# Altium project helix_4_single_shield_host.PrjPcb
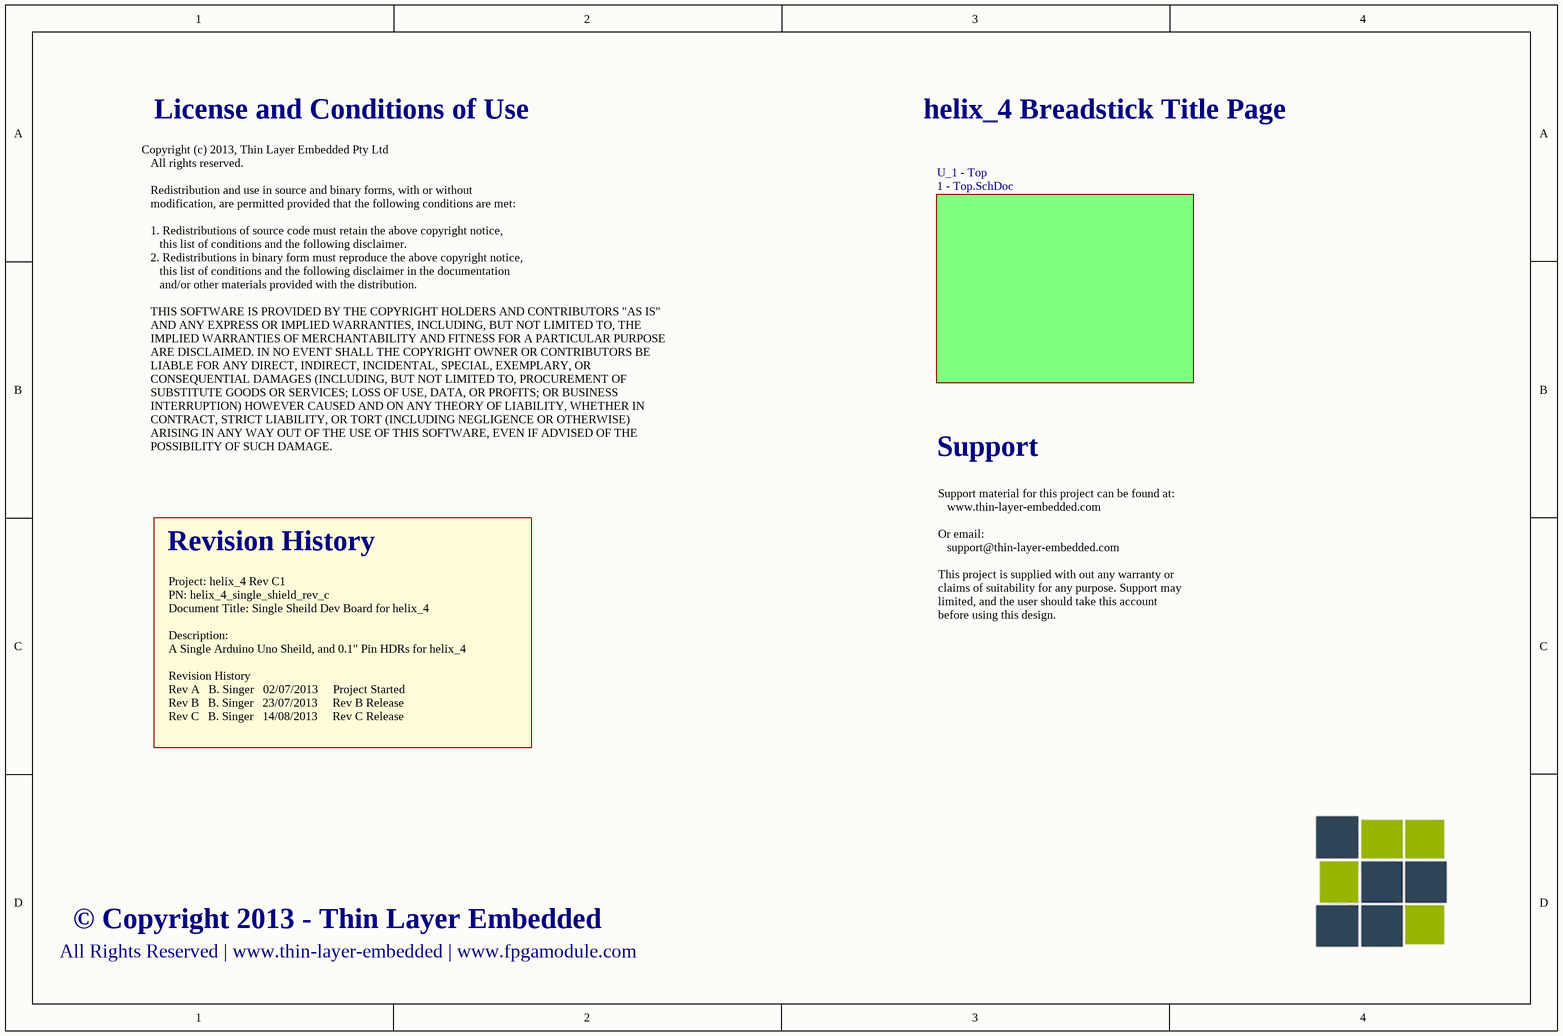
[diagram p0: 0 - Title.SchDoc]
4 sheets, 77 parts. Net scope: flat (ports and power ports of the same name join across sheets).
Board file: helix_4_single_shield_host.PcbDoc
Sheets:
  0 - Title.SchDoc
    U_1 - Top = 1 - Top.SchDoc
      U_3 - PSOC Blaster.ADC = 3 - PSOC & Power.SchDoc
      U_2 - IO Socket 0 = 2 - IO Socket 0.SchDoc

## Sheet 0 - Title.SchDoc
size A4

### Sub-sheets
U_1 - Top = 1 - Top.SchDoc: no entries

### Notes on the sheet
- License and Conditions of Use
- helix_4 Breadstick Title Page
- Copyright (c) 2013, Thin Layer Embedded Pty Ltd
  All rights reserved.
  Redistribution and use in source and binary forms, with or without
  modification, are permitted provided that the following conditions are met:
  1. Redistributions of source code must retain the above copyright notice,
  this list of conditions and the following disclaimer.
  2. Redistributions in binary form must reproduce the above copyright notice,
  this list of conditions and the following disclaimer in the documentation
  and/or other materials provided with the distribution.
  THIS SOFTWARE IS PROVIDED BY THE COPYRIGHT HOLDERS AND CONTRIBUTORS "AS IS"
  AND ANY EXPRESS OR IMPLIED WARRANTIES, INCLUDING, BUT NOT LIMITED TO, THE
  IMPLIED WARRANTIES OF MERCHANTABILITY AND FITNESS FOR A PARTICULAR PURPOSE
  ARE DISCLAIMED. IN NO EVENT SHALL THE COPYRIGHT OWNER OR CONTRIBUTORS BE
  LIABLE FOR ANY DIRECT, INDIRECT, INCIDENTAL, SPECIAL, EXEMPLARY, OR
  CONSEQUENTIAL DAMAGES (INCLUDING, BUT NOT LIMITED TO, PROCUREMENT OF
  SUBSTITUTE GOODS OR SERVICES; LOSS OF USE, DATA, OR PROFITS; OR BUSINESS
  INTERRUPTION) HOWEVER CAUSED AND ON ANY THEORY OF LIABILITY, WHETHER IN
  CONTRACT, STRICT LIABILITY, OR TORT (INCLUDING NEGLIGENCE OR OTHERWISE)
  ARISING IN ANY WAY OUT OF THE USE OF THIS SOFTWARE, EVEN IF ADVISED OF THE
  POSSIBILITY OF SUCH DAMAGE.
- Support
- Revision History
- Support material for this project can be found at:
  www.thin-layer-embedded.com
  Or email:
  support@thin-layer-embedded.com
  This project is supplied with out any warranty or
  claims of suitability for any purpose. Support may
  limited, and the user should take this account
  before using this design.
- Project: helix_4 Rev C1
  PN: helix_4_single_shield_rev_c
  Document Title: Single Sheild Dev Board for helix_4
  Description:
  A Single Arduino Uno Sheild, and 0.1" Pin HDRs for helix_4
  Revision History
  Rev A   B. Singer   02/07/2013     Project Started
  Rev B   B. Singer   23/07/2013     Rev B Release
  Rev C   B. Singer   14/08/2013     Rev C Release
- All Rights Reserved | www.thin-layer-embedded | www.fpgamodule.com
- © Copyright 2013 - Thin Layer Embedded

## Sheet 1 - Top.SchDoc
size A3; PageSetup: Record=PageOptions|CenterHorizontal=True|CenterVertical=True|PrintScale=0.71|XCorrection=1.00|YCorrection=1.00|PrintKind=0|BorderSize=5000000|LeftOffset=0|BottomOffset=0|Orientation=2|PaperLength=2970|PaperWidth=2100|Scale=100|PaperSource=7|PrintQuality=-4|MediaType=1|DitherType=10|PaperKind=A4 (210 x 297 mm)|PrintScaleMode=1
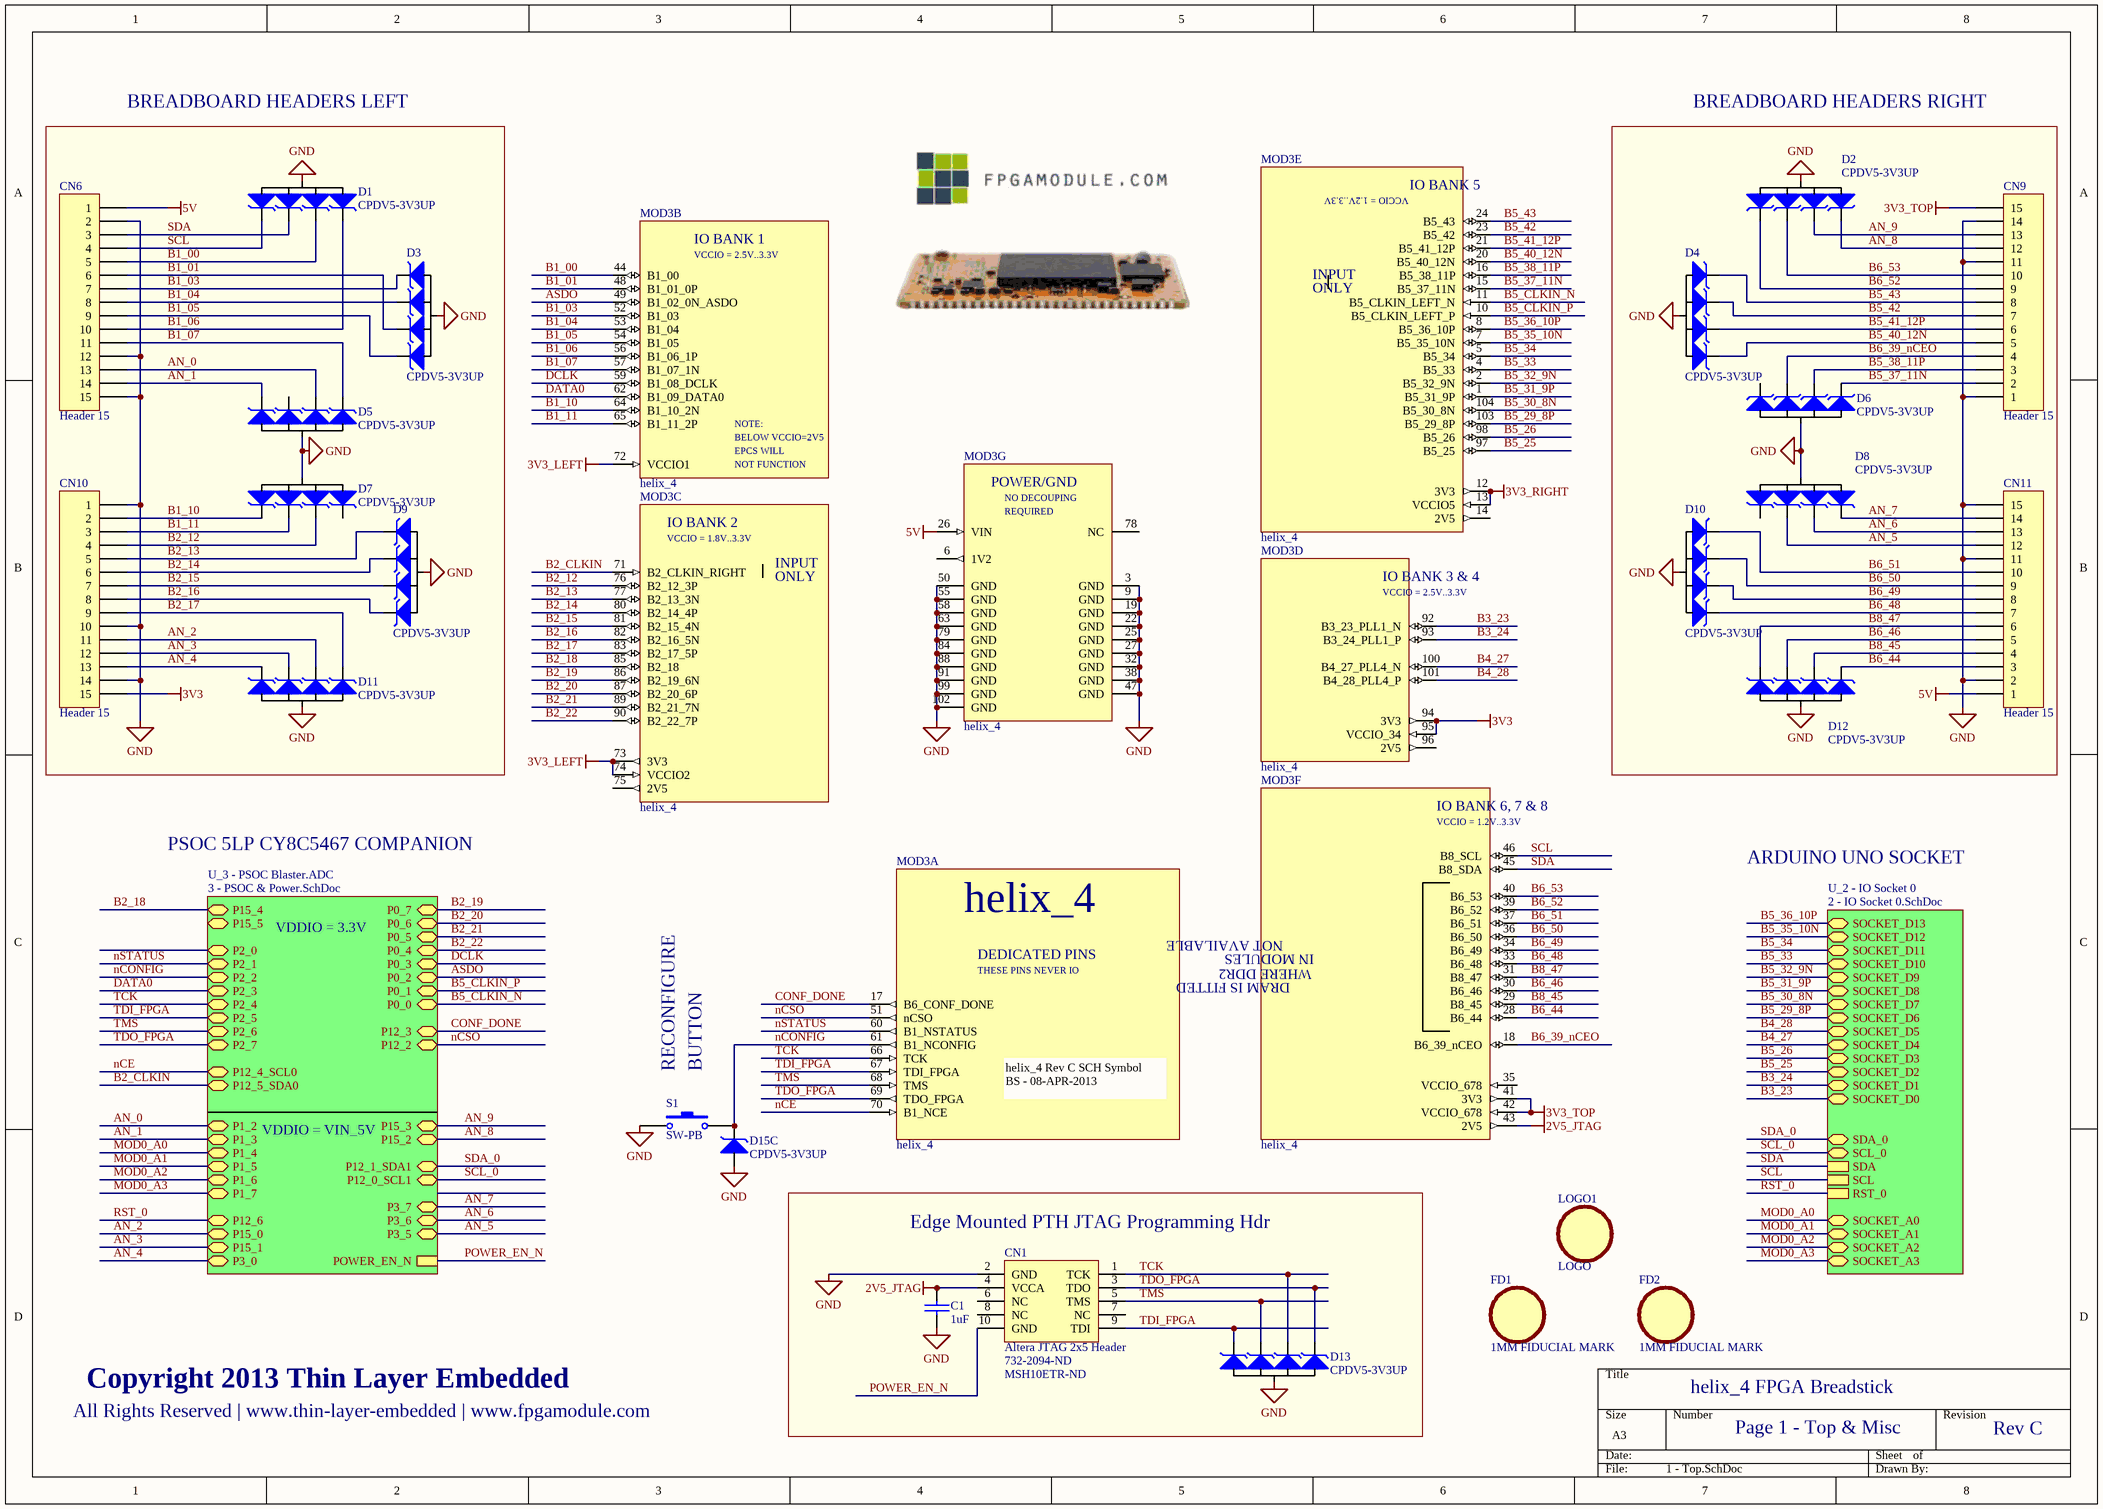
[diagram p1: 1 - Top.SchDoc]

### Parts
C1  1uF  [0805]
CN1  Altera JTAG 2x5 Header  Supplier Part Number 1: 732-2094-ND  Supplier Part Number 2: MSH10ETR-ND  [BOXHDR2X5_EDGE]
CN6  Header 15  [HDR1X15]
CN9  Header 15  [HDR1X15]
CN10  Header 15  [HDR1X15]
CN11  Header 15  [HDR1X15]
D1  CPDV5-3V3UP  [SOT-353]
D2  CPDV5-3V3UP  [SOT-353]
D3  CPDV5-3V3UP  [SOT-353]
D4  CPDV5-3V3UP  [SOT-353]
D5  CPDV5-3V3UP  [SOT-353]
D6  CPDV5-3V3UP  [SOT-353]
D7  CPDV5-3V3UP  [SOT-353]
D8  CPDV5-3V3UP  [SOT-353]
D9  CPDV5-3V3UP  [SOT-353]
D10  CPDV5-3V3UP  [SOT-353]
D11  CPDV5-3V3UP  [SOT-353]
D12  CPDV5-3V3UP  [SOT-353]
D13  CPDV5-3V3UP  [SOT-353]
D15  CPDV5-3V3UP  [sot-353]  (part C of 4)
FD1  1MM FIDUCIAL MARK  [FID_1MM]
FD2  1MM FIDUCIAL MARK  [FID_1MM]
LOGO1  LOGO  [LOGO_SMALL - SILK]
MOD3  helix_4  [HELIX_4_LCC104_HOST]  (parts A,B,C,D,E,F,G of 7)
S1  SW-PB  [FSM4JSMA]

### Blocks framed on the sheet
BREADBOARD HEADERS LEFT: CN6 CN10 D1 D3 D5 D7 D9 D11
BREADBOARD HEADERS RIGHT: CN9 CN11 D2 D4 D6 D8 D10 D12
Edge Mounted PTH JTAG Programming Hdr: C1 CN1 D13

### Sub-sheets
U_2 - IO Socket 0 = 2 - IO Socket 0.SchDoc: SCL, SDA, SDA_0, SCL_0, SOCKET_A0, SOCKET_A1, SOCKET_A2, SOCKET_A3, SOCKET_D0, SOCKET_D1, SOCKET_D2, SOCKET_D3, SOCKET_D4, SOCKET_D5, SOCKET_D6, SOCKET_D7, SOCKET_D8, SOCKET_D9, SOCKET_D10, SOCKET_D11, SOCKET_D12, SOCKET_D13, RST_0
U_3 - PSOC Blaster.ADC = 3 - PSOC & Power.SchDoc: P15_4, P15_5, P12_6, P2_0, P1_5, P1_6, P1_7, P2_1, P2_2, P2_3, P2_4, P2_5, P2_6, P2_7, P12_3, P12_2, POWER_EN_N, P0_0, P1_4, P1_3, P12_4_SCL0, P12_5_SDA0, P12_1_SDA1, P12_0_SCL1, P1_2, P0_1, P0_2, P0_3, P0_4, P0_5, P0_6, P0_7, P3_5, P3_6, P3_7, P15_0, P15_2, P15_3, P15_1, P3_0

### Nets
2V5_JTAG: C1.2 CN1.4(VCCA) MOD3.43(2V5)
3V3: CN10.15 MOD3.94(3V3) MOD3.95(VCCIO_34)
3V3_LEFT: MOD3.72(VCCIO1) MOD3.73(3V3) MOD3.74(VCCIO2)
3V3_RIGHT: MOD3.12(3V3) MOD3.13(VCCIO5)
3V3_TOP: CN9.15 MOD3.41(3V3) MOD3.42(VCCIO_678)
5V: CN6.1 CN11.1 MOD3.26(VIN)
GND: C1.1 CN1.2(GND) CN6.2 CN6.12 CN6.15 CN9.1 CN9.11 CN9.14 CN10.1 CN10.10 CN10.14 CN11.2 CN11.11 CN11.15 D1.2(A) D2.2(A) D3.2(A) D4.2(A) D5.2(A) D6.2(A) D7.2(A) D8.2(A) D9.2(A) D10.2(A) D11.2(A) D12.2(A) D13.2(A) D15.2(A) MOD3.3(GND) MOD3.9(GND) MOD3.19(GND) MOD3.22(GND) MOD3.25(GND) MOD3.27(GND) MOD3.32(GND) MOD3.38(GND) MOD3.47(GND) MOD3.50(GND) MOD3.55(GND) MOD3.58(GND) MOD3.63(GND) MOD3.79(GND) MOD3.84(GND) MOD3.88(GND) MOD3.91(GND) MOD3.99(GND) MOD3.102(GND) S1.1
AN_0: CN6.13 D5.5(K1) ; sheet U_3 - PSOC Blaster.ADC/P1_2
AN_1: CN6.14 D5.3(K1) ; sheet U_3 - PSOC Blaster.ADC/P1_3
AN_2: CN10.11 D11.5(K1) ; sheet U_3 - PSOC Blaster.ADC/P15_0
AN_3: CN10.12 D11.1(K2) ; sheet U_3 - PSOC Blaster.ADC/P15_1
AN_4: CN10.13 D11.3(K1) ; sheet U_3 - PSOC Blaster.ADC/P3_0
AN_5: CN11.12 D8.5(K1) ; sheet U_3 - PSOC Blaster.ADC/P3_5
AN_6: CN11.13 D8.1(K2) ; sheet U_3 - PSOC Blaster.ADC/P3_6
AN_7: CN11.14 D8.3(K1) ; sheet U_3 - PSOC Blaster.ADC/P3_7
AN_8: CN9.12 D2.4(K2) ; sheet U_3 - PSOC Blaster.ADC/P15_2
AN_9: CN9.13 D2.5(K1) ; sheet U_3 - PSOC Blaster.ADC/P15_3
ASDO: MOD3.49(B1_02_0N_ASDO) ; sheet U_3 - PSOC Blaster.ADC/P0_2
B1_00: CN6.5 D1.1(K2) MOD3.44(B1_00)
B1_01: CN6.6 D3.5(K1) MOD3.48(B1_01_0P)
B1_03: CN6.7 D3.3(K1) MOD3.52(B1_03)
B1_04: CN6.8 D3.1(K2) MOD3.53(B1_04)
B1_05: CN6.9 D3.4(K2) MOD3.54(B1_05)
B1_06: CN6.10 D1.3(K1) MOD3.56(B1_06_1P)
B1_07: CN6.11 D5.4(K2) MOD3.57(B1_07_1N)
B1_10: CN10.2 D7.4(K2) MOD3.64(B1_10_2N)
B1_11: CN10.3 D7.5(K1) MOD3.65(B1_11_2P)
B2_12: CN10.4 D7.1(K2) MOD3.76(B2_12_3P)
B2_13: CN10.5 D9.4(K2) MOD3.77(B2_13_3N)
B2_14: CN10.6 D9.5(K1) MOD3.80(B2_14_4P)
B2_15: CN10.7 D9.1(K2) MOD3.81(B2_15_4N)
B2_16: CN10.8 D9.3(K1) MOD3.82(B2_16_5N)
B2_17: CN10.9 D11.4(K2) MOD3.83(B2_17_5P)
B2_18: MOD3.85(B2_18) ; sheet U_3 - PSOC Blaster.ADC/P15_4
B2_19: MOD3.86(B2_19_6N) ; sheet U_3 - PSOC Blaster.ADC/P0_7
B2_20: MOD3.87(B2_20_6P) ; sheet U_3 - PSOC Blaster.ADC/P0_6
B2_21: MOD3.89(B2_21_7N) ; sheet U_3 - PSOC Blaster.ADC/P0_5
B2_22: MOD3.90(B2_22_7P) ; sheet U_3 - PSOC Blaster.ADC/P0_4
B2_CLKIN: MOD3.71(B2_CLKIN_RIGHT) ; sheet U_3 - PSOC Blaster.ADC/P12_5_SDA0
B3_23: MOD3.92(B3_23_PLL1_N) ; sheet U_2 - IO Socket 0/SOCKET_D0
B3_24: MOD3.93(B3_24_PLL1_P) ; sheet U_2 - IO Socket 0/SOCKET_D1
B4_27: MOD3.100(B4_27_PLL4_N) ; sheet U_2 - IO Socket 0/SOCKET_D4
B4_28: MOD3.101(B4_28_PLL4_P) ; sheet U_2 - IO Socket 0/SOCKET_D5
B5_25: MOD3.97(B5_25) ; sheet U_2 - IO Socket 0/SOCKET_D2
B5_26: MOD3.98(B5_26) ; sheet U_2 - IO Socket 0/SOCKET_D3
B5_29_8P: MOD3.103(B5_29_8P) ; sheet U_2 - IO Socket 0/SOCKET_D6
B5_30_8N: MOD3.104(B5_30_8N) ; sheet U_2 - IO Socket 0/SOCKET_D7
B5_31_9P: MOD3.1(B5_31_9P) ; sheet U_2 - IO Socket 0/SOCKET_D8
B5_32_9N: MOD3.2(B5_32_9N) ; sheet U_2 - IO Socket 0/SOCKET_D9
B5_33: MOD3.4(B5_33) ; sheet U_2 - IO Socket 0/SOCKET_D10
B5_34: MOD3.5(B5_34) ; sheet U_2 - IO Socket 0/SOCKET_D11
B5_35_10N: MOD3.7(B5_35_10N) ; sheet U_2 - IO Socket 0/SOCKET_D12
B5_36_10P: MOD3.8(B5_36_10P) ; sheet U_2 - IO Socket 0/SOCKET_D13
B5_37_11N: CN9.2 D6.3(K1) MOD3.15(B5_37_11N)
B5_38_11P: CN9.3 D6.1(K2) MOD3.16(B5_38_11P)
B5_40_12N: CN9.5 D4.3(K1) MOD3.20(B5_40_12N)
B5_41_12P: CN9.6 D4.1(K2) MOD3.21(B5_41_12P)
B5_42: CN9.7 D4.5(K1) MOD3.23(B5_42)
B5_43: CN9.8 D4.4(K2) MOD3.24(B5_43)
B5_CLKIN_N: MOD3.11(B5_CLKIN_LEFT_N) ; sheet U_3 - PSOC Blaster.ADC/P0_0
B5_CLKIN_P: MOD3.10(B5_CLKIN_LEFT_P) ; sheet U_3 - PSOC Blaster.ADC/P0_1
B6_39_nCEO: CN9.4 D6.5(K1) MOD3.18(B6_39_nCEO)
B6_44: CN11.3 D12.4(K2) MOD3.28(B6_44)
B6_46: CN11.5 D12.1(K2) MOD3.30(B6_46)
B6_48: CN11.7 D10.4(K2) MOD3.33(B6_48)
B6_49: CN11.8 D10.5(K1) MOD3.34(B6_49)
B6_50: CN11.9 D10.1(K2) MOD3.36(B6_50)
B6_51: CN11.10 D10.3(K1) MOD3.37(B6_51)
B6_52: CN9.9 D2.3(K1) MOD3.39(B6_52)
B6_53: CN9.10 D2.1(K2) MOD3.40(B6_53)
B8_45: CN11.4 D12.5(K1) MOD3.29(B8_45)
B8_47: CN11.6 D12.3(K1) MOD3.31(B8_47)
CONF_DONE: MOD3.17(B6_CONF_DONE) ; sheet U_3 - PSOC Blaster.ADC/P12_3
DATA0: MOD3.62(B1_09_DATA0) ; sheet U_3 - PSOC Blaster.ADC/P2_3
DCLK: MOD3.59(B1_08_DCLK) ; sheet U_3 - PSOC Blaster.ADC/P0_3
MOD0_A0: sheet U_3 - PSOC Blaster.ADC/P1_4, sheet U_2 - IO Socket 0/SOCKET_A0
MOD0_A1: sheet U_3 - PSOC Blaster.ADC/P1_5, sheet U_2 - IO Socket 0/SOCKET_A1
MOD0_A2: sheet U_3 - PSOC Blaster.ADC/P1_6, sheet U_2 - IO Socket 0/SOCKET_A2
MOD0_A3: sheet U_3 - PSOC Blaster.ADC/P1_7, sheet U_2 - IO Socket 0/SOCKET_A3
nCE: MOD3.70(B1_NCE) ; sheet U_3 - PSOC Blaster.ADC/P12_4_SCL0
nCONFIG: D15.5(K3) MOD3.61(B1_NCONFIG) S1.2 ; sheet U_3 - PSOC Blaster.ADC/P2_2
nCSO: MOD3.51(nCSO) ; sheet U_3 - PSOC Blaster.ADC/P12_2
nSTATUS: MOD3.60(B1_NSTATUS) ; sheet U_3 - PSOC Blaster.ADC/P2_1
POWER_EN_N: CN1.10(GND) ; sheet U_3 - PSOC Blaster.ADC/POWER_EN_N
RST_0: sheet U_3 - PSOC Blaster.ADC/P12_6, sheet U_2 - IO Socket 0/RST_0
SCL: CN6.4 D1.4(K2) MOD3.46(B8_SCL) ; sheet U_2 - IO Socket 0/SCL
SCL_0: sheet U_3 - PSOC Blaster.ADC/P12_0_SCL1, sheet U_2 - IO Socket 0/SCL_0
SDA: CN6.3 D1.5(K1) MOD3.45(B8_SDA) ; sheet U_2 - IO Socket 0/SDA
SDA_0: sheet U_3 - PSOC Blaster.ADC/P12_1_SDA1, sheet U_2 - IO Socket 0/SDA_0
TCK: CN1.1(TCK) D13.5(K1) MOD3.66(TCK) ; sheet U_3 - PSOC Blaster.ADC/P2_4
TDI_FPGA: CN1.9(TDI) D13.3(K1) MOD3.67(TDI_FPGA) ; sheet U_3 - PSOC Blaster.ADC/P2_5
TDO_FPGA: CN1.3(TDO) D13.4(K2) MOD3.69(TDO_FPGA) ; sheet U_3 - PSOC Blaster.ADC/P2_7
TMS: CN1.5(TMS) D13.1(K2) MOD3.68(TMS) ; sheet U_3 - PSOC Blaster.ADC/P2_6

Not connected (* = marked no-connect by the designer): CN1 6(NC) 7(NC) 8(NC); D5 1(K2); D6 4(K2); D7 3(K1); D8 4(K2); FD1 1(FID); FD2 1(FID); LOGO1 1(FID); MOD3 6(1V2) 14(2V5) 35(VCCIO_678) 75(2V5) 78(NC) 96(2V5)

### Notes on the sheet
- PSOC 5LP CY8C5467 COMPANION
- ARDUINO UNO SOCKET
- VDDIO = 3.3V
- RECONFIGURE
- BUTTON
- VDDIO = VIN_5V
- Copyright 2013 Thin Layer Embedded
- helix_4 FPGA Breadstick
- All Rights Reserved | www.thin-layer-embedded | www.fpgamodule.com
- Page 1 - Top & Misc
- Rev C
- (in symbol helix_4 Rev C Module, part A) DEDICATED PINS; THESE PINS NEVER IO; helix_4 Rev C SCH Symbol / BS - 08-APR-2013 /
- (in symbol helix_4 Rev C Module, part B) IO BANK 1; VCCIO = 2.5V..3.3V; NOTE:; BELOW VCCIO=2V5; EPCS WILL; NOT FUNCTION
- (in symbol helix_4 Rev C Module, part C) IO BANK 2; VCCIO = 1.8V..3.3V; INPUT; ONLY
- (in symbol helix_4 Rev C Module, part D) IO BANK 3 & 4; VCCIO = 2.5V..3.3V
- (in symbol helix_4 Rev C Module, part E) IO BANK 5; VCCIO = 1.2V..3.3V; INPUT; ONLY
- (in symbol helix_4 Rev C Module, part F) IO BANK 6, 7 & 8; VCCIO = 1.2V..3.3V; NOT AVAILABLE; IN MODULES; WHERE DDR2; DRAM IS FITTED
- (in symbol helix_4 Rev C Module, part G) POWER/GND; NO DECOUPING; REQUIRED

### Library data of the parts
C1 = CAP: Capacitor
CN1 = Altera JTAG 2x5 Header: Header, 5-Pin, Dual row; Manufacturer: Wurth Electronics Inc; Manufacturer Part Number: 61201021621; Description: BOX HEADER 2.54MM MALE STR 10POS; Connector Type: Header, Shrouded; Number of Positions: 10; Number of Positions Loaded: All; Pitch: 0.100" (2.54mm); LatestRevisionDate: 17-Jul-2002; LatestRevisionNote: Re-released for DXP Platform.; Publisher: Altium Limited; Supplier 1: Digi-Key; RoHS: RoHS Compliant; Category: Connectors, Interconnects; Stock 1: 324; Pricing 1: 1=0.97, 25=0.8052, 100=0.713, 250=0.63252, 500=0.575, 1000=0.46, 2500=0.4025, 5000=0.3335, 10000=0.3059 (USD); Contact Type: Male Pin; Number of Rows: 2; Row Spacing: 0.100" (2.54mm); Contact Mating Length: -; Mounting Type: Through Hole; Termination: Solder; Fastening Type: -; Features: -; Contact Finish: Gold; Contact Finish Thickness: -; Color: Black; Packaging: Tray; ComponentLink1URL: http://www.we-online.de/eican/media/pdf/6120xx21621.pdf; ComponentLink1Description: http://www.we-online.de/eican/media/pdf/6120xx21621.pdf; Supplier 2: Digi-Key
CN6 CN9-CN11 = Header 15: Header, 15-Pin; LatestRevisionDate: 17-Jul-2002; LatestRevisionNote: Re-released for DXP Platform.; Publisher: Altium Limited
D1-D13 = 4CH ESD DIODE: 4CH ESD DIODE 3V3/3.5V
D15 = 4CH ESD DIODE (SPLIT): 4CH ESD DIODE 3V3/3.5V
FD1 FD2 LOGO1 = FID
MOD3 = helix_4 Rev C Module
S1 = SW-PB: Switch; Published: 24-Mar-1999; LatestRevisionDate: 17-Jul-2002; LatestRevisionNote: Re-released for DXP Platform.; PackageReference: SPST-2; Publisher: Altium Limited

## Sheet 3 - PSOC & Power.SchDoc
size A3; PageSetup: Record=PageOptions|CenterHorizontal=True|CenterVertical=True|PrintScale=1.00|XCorrection=1.00|YCorrection=1.00|PrintKind=1|BorderSize=5000000|LeftOffset=0|BottomOffset=0|Orientation=2|PaperLength=2970|PaperWidth=2100|Scale=100|PaperSource=7|PrintQuality=-4|MediaType=1|DitherType=10|PaperKind=A4 (210 x 297 mm)|PrintScaleMode=0
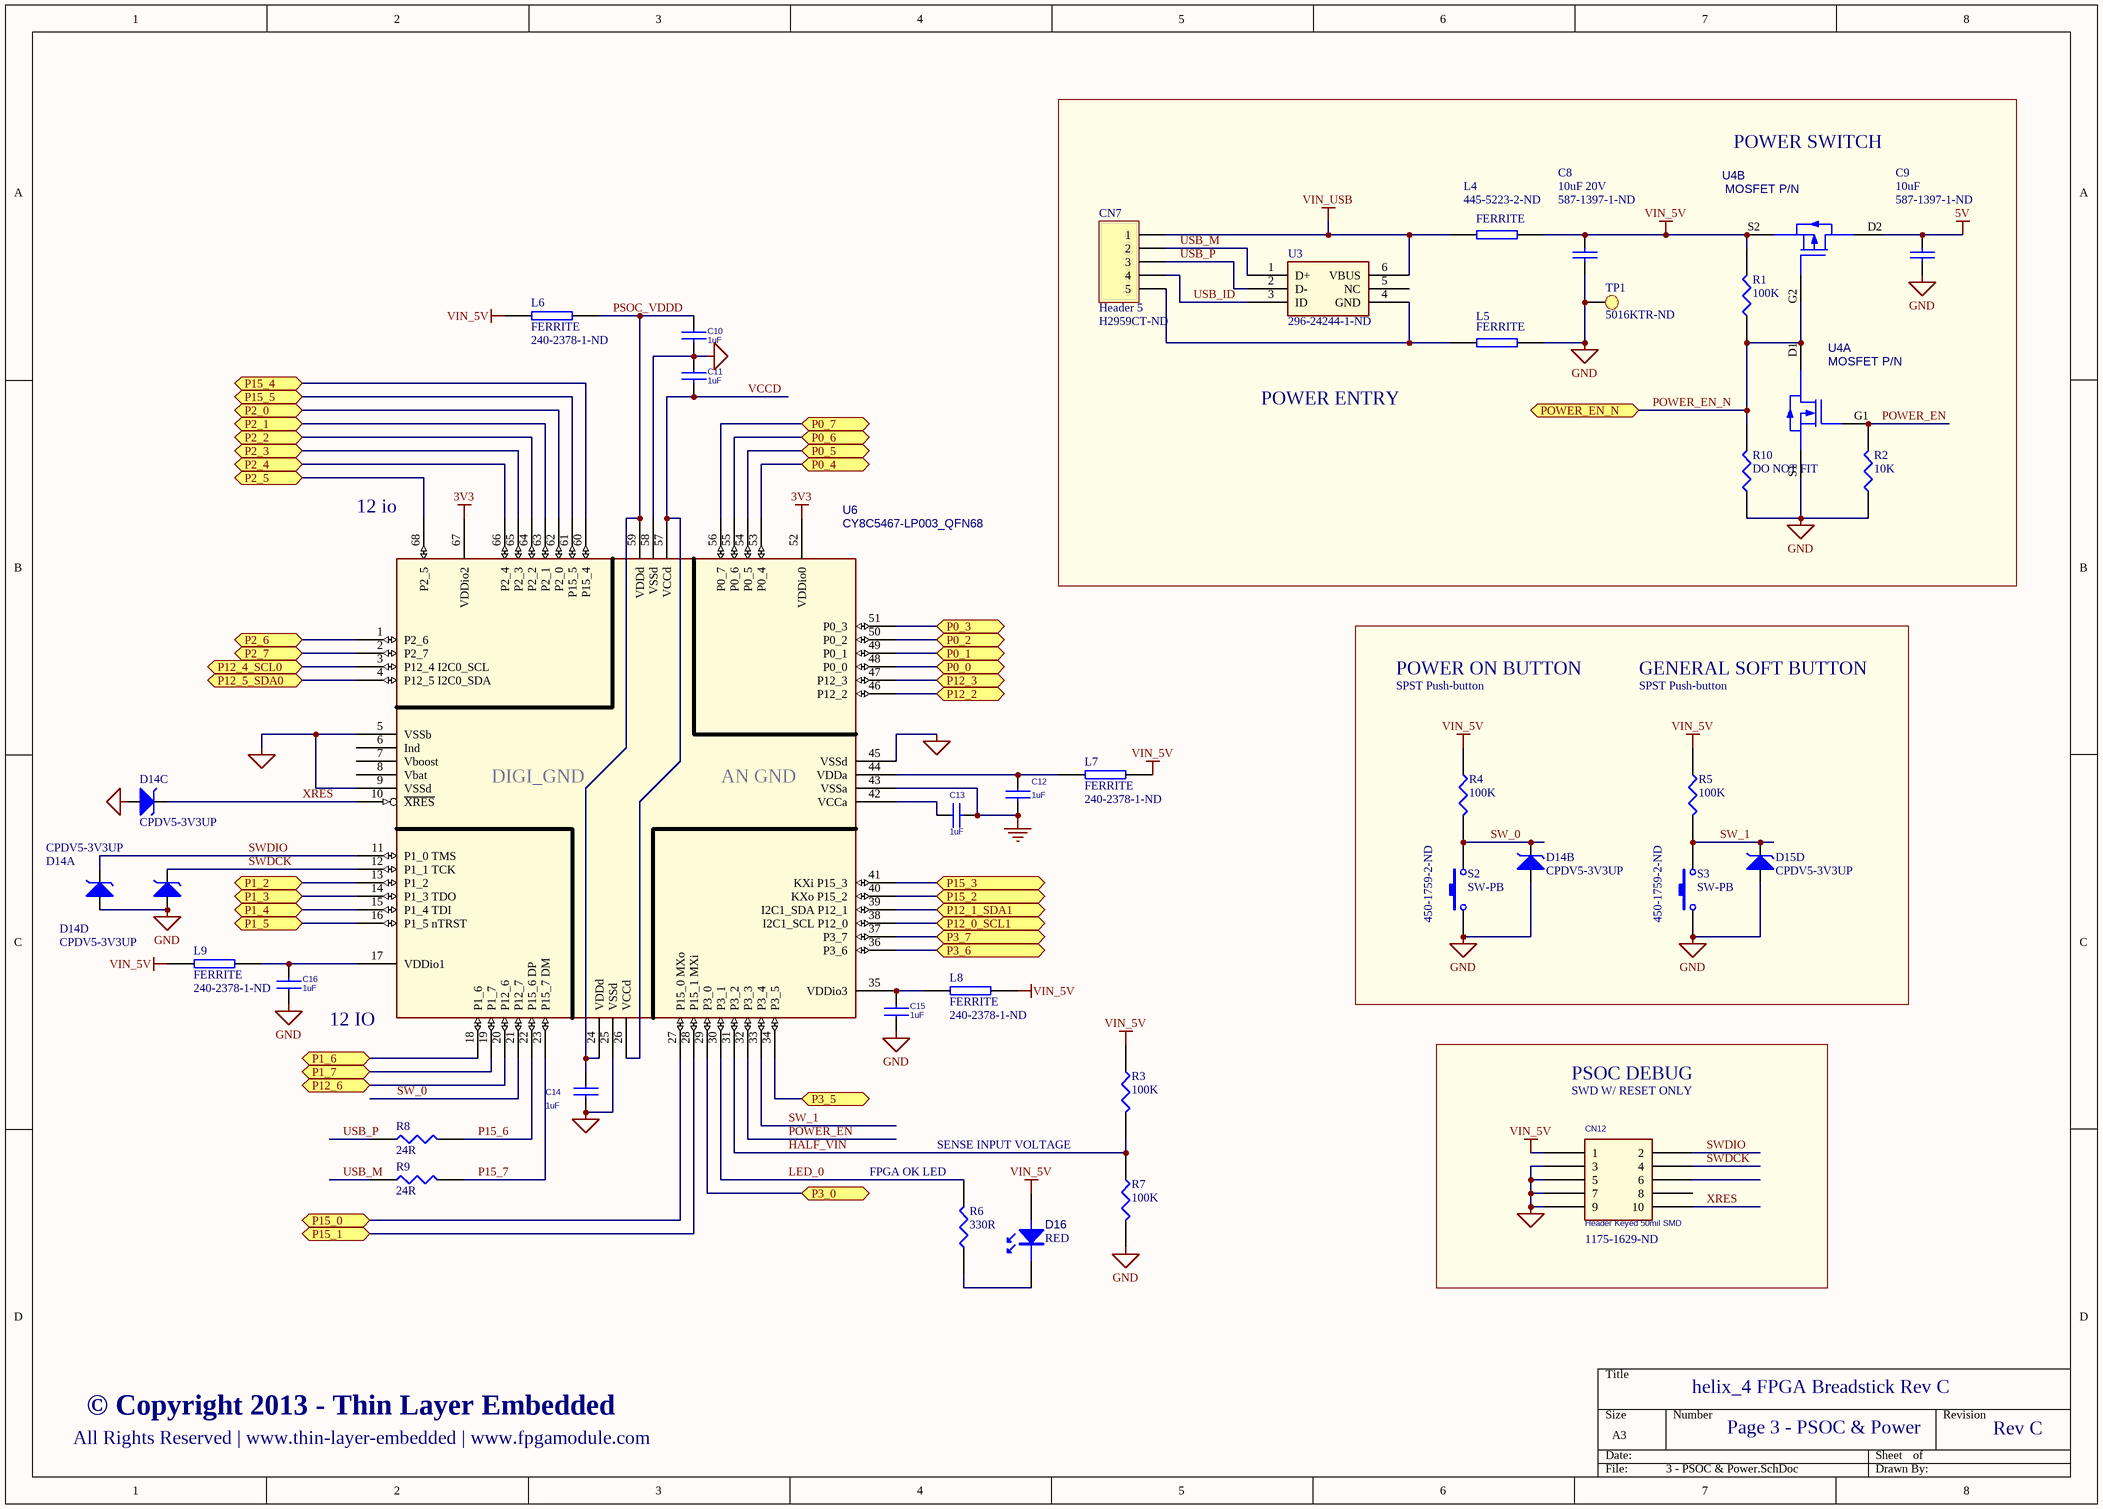
[diagram p2: 3 - PSOC & Power.SchDoc]

### Parts
C8  10uF 20V  Supplier Part Number 1: 587-1397-1-ND  [0805]
C9  10uF  Supplier Part Number 1: 587-1397-1-ND  [0805]
C10  1uF  [0402_HD]
C11  1uF  [0402_HD]
C12  1uF  [0402_HD]
C13  1uF  [0402_HD]
C14  1uF  [0402_HD]
C15  1uF  [0402_HD]
C16  1uF  [0402_HD]
CN7  Header 5  Supplier Part Number 1: H2959CT-ND  [USB_MINI_B]
CN12  Header Keyed 50mil SMD  Supplier Part Number 1: 1175-1629-ND  [SBH41_127_10W_DUAL]
D14  CPDV5-3V3UP  [sot-353]  (parts A,B,C,D of 4)
D15  CPDV5-3V3UP  [sot-353]  (part D of 4)
D16  RED  [0805_HD_LED]
L4  FERRITE  Supplier Part Number 1: 445-5223-2-ND  [0805]
L5  FERRITE  [0805]
L6  FERRITE  Supplier Part Number 1: 240-2378-1-ND  [0402_HD]
L7  FERRITE  Supplier Part Number 1: 240-2378-1-ND  [0402_HD]
L8  FERRITE  Supplier Part Number 1: 240-2378-1-ND  [0402_HD]
L9  FERRITE  Supplier Part Number 1: 240-2378-1-ND  [0402_HD]
R1  100K  [0805]
R2  10K  [0805]
R3  100K  [0805]
R4  100K  [0805]
R5  100K  [0805]
R6  330R  [0805]
R7  100K  [0805]
R8  24R  [0402_HD]
R9  24R  [0402_HD]
R10  DO NOT FIT  [0805]
S2  SW-PB  Supplier Part Number 1: 450-1759-2-ND  [FSM4JSMA]
S3  SW-PB  Supplier Part Number 1: 450-1759-2-ND  [FSM4JSMA]
TP1  Supplier Part Number 2: 5016KTR-ND  [TEST_POINT]  (hidden comment: Test Point)
U3  Supplier Part Number 1: 296-24244-1-ND  [DRY6]  (hidden comment: SN65220 USB TVS SOT23-6_0)
U4  MOSFET P/N  [WSMini6-F1-B]  (parts A,B of 2)
U6  CY8C5467-LP003_QFN68  [PSOC_QFN68_HD]

### Blocks framed on the sheet
PSOC DEBUG: CN12

### Ports
P0_0, P0_1, P0_2, P0_3, P0_4, P0_5, P0_6, P0_7, P1_2, P1_3, P1_4, P1_5, P1_6, P1_7, P2_0, P2_1, P2_2, P2_3, P2_4, P2_5, P2_6, P2_7, P3_0, P3_5, P3_6, P3_7, P12_0_SCL1, P12_1_SDA1, P12_2, P12_3, P12_4_SCL0, P12_5_SDA0, P12_6, P15_0, P15_1, P15_2, P15_3, P15_4, P15_5, POWER_EN_N

### Nets
3V3: U6.52(VDDio0) U6.67(VDDio2)
5V: C9.1 U4.D2
GND: C8.2 C9.2 C10.2 C11.1 C12.2 C13.2 C14.2 C15.1 C16.1 CN12.3 CN12.5 CN12.7 CN12.9 D14.2(A) D15.2(A) L5.2 R2.1 R7.2 R10.1 S2.1 S3.1 TP1.1 U4.S1 U6.5(VSSb) U6.9(VSSd) U6.25(VSSd) U6.43(VSSa) U6.45(VSSd) U6.58(VSSd)
VIN_5V: C8.1 CN12.1 D16.A L4.2 L6.1 L7.2 L8.2 L9.2 R1.2 R3.1 R4.1 R5.1 U4.S2
VIN_USB: CN7.1 L4.1 U3.6(VBUS)
HALF_VIN: R3.2 R7.1 U6.31(P3_2)
LED_0: R6.2 U6.30(P3_1)
P15_6: R8.1 U6.22(P15_6_DP)
P15_7: R9.1 U6.23(P15_7_DM)
POWER_EN: R2.2 U4.G1 U6.32(P3_3)
POWER_EN_N: R1.1 R10.2 U4.D1 U4.G2 ; port POWER_EN_N
PSOC_VDDD: C10.1 C14.1 L6.2 U6.24(VDDd) U6.59(VDDd)
SW_0: D14.1(K2) R4.2 S2.2 U6.21(P12_7)
SW_1: D15.4(K4) R5.2 S3.2 U6.33(P3_4)
SWDCK: CN12.4 D14.4(K4) U6.12(P1_1_TCK)
SWDIO: CN12.2 D14.3(K1) U6.11(P1_0_TMS)
USB_ID: CN7.4 U3.3(ID)
USB_M: CN7.2 R9.2 U3.1(D+)
USB_P: CN7.3 R8.2 U3.2(D-)
VCCD: C11.2 U6.26(VCCd) U6.57(VCCd)
XRES: CN12.10 D14.5(K3) U6.10(~{XRES})
NetC12_1: C12.1 L7.1 U6.44(VDDa)
NetC13_1: C13.1 U6.42(VCCa)
NetC15_2: C15.2 L8.1 U6.35(VDDio3)
NetC16_2: C16.2 L9.1 U6.17(VDDio1)
NetCN7_5: CN7.5 L5.1 U3.4(GND)
NetD16_K: D16.K R6.1
NetU6_1: U6.1(P2_6) ; port P2_6
NetU6_2: U6.2(P2_7) ; port P2_7
NetU6_3: U6.3(P12_4_I2C0_SCL) ; port P12_4_SCL0
NetU6_4: U6.4(P12_5_I2C0_SDA) ; port P12_5_SDA0
NetU6_13: U6.13(P1_2) ; port P1_2
NetU6_14: U6.14(P1_3_TDO) ; port P1_3
NetU6_15: U6.15(P1_4_TDI) ; port P1_4
NetU6_16: U6.16(P1_5_nTRST) ; port P1_5
NetU6_18: U6.18(P1_6) ; port P1_6
NetU6_19: U6.19(P1_7) ; port P1_7
NetU6_20: U6.20(P12_6) ; port P12_6
NetU6_27: U6.27(P15_0_MXo) ; port P15_0
NetU6_28: U6.28(P15_1_MXi) ; port P15_1
NetU6_29: U6.29(P3_0) ; port P3_0
NetU6_34: U6.34(P3_5) ; port P3_5
NetU6_36: U6.36(P3_6) ; port P3_6
NetU6_37: U6.37(P3_7) ; port P3_7
NetU6_38: U6.38(I2C1_SCL_P12_0) ; port P12_0_SCL1
NetU6_39: U6.39(I2C1_SDA_P12_1) ; port P12_1_SDA1
NetU6_40: U6.40(KXo_P15_2) ; port P15_2
NetU6_41: U6.41(KXi_P15_3) ; port P15_3
NetU6_46: U6.46(P12_2) ; port P12_2
NetU6_47: U6.47(P12_3) ; port P12_3
NetU6_48: U6.48(P0_0) ; port P0_0
NetU6_49: U6.49(P0_1) ; port P0_1
NetU6_50: U6.50(P0_2) ; port P0_2
NetU6_51: U6.51(P0_3) ; port P0_3
NetU6_53: U6.53(P0_4) ; port P0_4
NetU6_54: U6.54(P0_5) ; port P0_5
NetU6_55: U6.55(P0_6) ; port P0_6
NetU6_56: U6.56(P0_7) ; port P0_7
NetU6_60: U6.60(P15_4) ; port P15_4
NetU6_61: U6.61(P15_5) ; port P15_5
NetU6_62: U6.62(P2_0) ; port P2_0
NetU6_63: U6.63(P2_1) ; port P2_1
NetU6_64: U6.64(P2_2) ; port P2_2
NetU6_65: U6.65(P2_3) ; port P2_3
NetU6_66: U6.66(P2_4) ; port P2_4
NetU6_68: U6.68(P2_5) ; port P2_5

Not connected (* = marked no-connect by the designer): CN12 6 8; U3 5(NC); U6 6(Ind) 7(Vboost) 8(Vbat)

### Notes on the sheet
- POWER SWITCH
- POWER ENTRY
- (near U6) 12 io
- POWER ON BUTTON
- SPST Push-button
- GENERAL SOFT BUTTON
- (near U6) DIGI_GND
- (near U6) AN GND
- (near U6) 12 IO
- SWD W/ RESET ONLY
- (near R6) FPGA OK LED
- SENSE INPUT VOLTAGE
- helix_4 FPGA Breadstick Rev C
- All Rights Reserved | www.thin-layer-embedded | www.fpgamodule.com
- © Copyright 2013 - Thin Layer Embedded
- Page 3 - PSOC & Power
- Rev C

### Library data of the parts
C8 C9 = CAP: Capacitor; Supplier 1: Digi-Key
C10 C12 = CAP: CAP, CER, 10 uF, 16 V, 5%, X5R, 0805, SMD; Part Number: 700-00105; ALT_SYMBOLS: CAPC2012X140N,CAPC2012X140L,CAPC2012X140M; Last Edit By: SNF; CLASS: DISCRETE; Rated Voltage: 16 V; Operating Temperature Maximum: 85 C; Operating Temperature Minimum: -25 C; Package Size: 0805; FPLIST: CAPC2012X140N,CAPC2012X140L,CAPC2012X140M; Tolerance: 5%
C11 C13 C15 C16 = CAP: CAP CER 1.2 uF 10 V 10% X5R 0805 SMD; Part Number: 700-00097; Last Edit By: SNF; CLASS: DISCRETE; FPLIST: CAPC2012X100N,CAPC2012X100L,CAPC2012X100M; Rated Voltage: 10 V; Package Size: 0805; Tolerance: 10%
C14 = CAP: CAP, CER, 1.0 uF, 10 V, 10%, X5R, 0603, SMD; Part Number: 700-00111; ALT_SYMBOLS: CAPC1608X55N,CAPC1608X55L,CAPC1608X55M; Last Edit By: SNF; CLASS: DISCRETE; Rated Voltage: 10 V; Tolerance: 10%; FPLIST: CAPC1608X55N,CAPC1608X55L,CAPC1608X55M; Package Size: 0603; Operating Temperature Minimum: -55 C; Operating Temperature Maximum: 85 C
CN7 = Header 5: Header, 5-Pin; LatestRevisionDate: 17-Jul-2002; LatestRevisionNote: Re-released for DXP Platform.; Publisher: Altium Limited; Supplier 1: Digi-Key
CN12 = HDR_2X5: CONN, HDR, KEYED, 2x5, 0.050", Gold, SMD; Part Number: 400-00018; Last Edit By: SNF; CLASS: IO; ALT_SYMBOLS: ftsh-105-xx-x-dv-k; Package Type: SMD; Operating Temperature Minimum: -55 C; Operating Temperature Maximum: 125 C; Supplier 1: Digi-Key
D14 D15 = 4CH ESD DIODE (SPLIT): 4CH ESD DIODE 3V3/3.5V
D16 = LED: Supplier 1: Digi-Key
L6-L9 = FERRITE: Manufacturer: Laird-Signal Integrity Products; Manufacturer Part Number: HI0805R800R-10; Description: FERRITE CHIP POWER 80 OHM SMD; Impedance @ Frequency: 80 Ohm @ 100MHz; Current Rating: 5A; DC Resistance (DCR): 10.00 mOhm Max; Filter Type: Differential Mode - Single; Number of Lines: 1; Supplier 1: Digi-Key; RoHS: RoHS Compliant; Category: Filters; Stock 1: 36575; Pricing 1: 10=0.089, 50=0.0768, 100=0.0708, 250=0.059, 500=0.0531, 1000=0.0472 (USD); Package / Case: 0805 (2012 metric); Mounting Type: Surface Mount; Packaging: Cut Tape (CT); ComponentLink1URL: http://www.steward.com/view_print.asp?St_PartNo=HI0805R800R-10; ComponentLink1Description: http://www.steward.com/view_print.asp?St_PartNo=HI0805R800R-10
R1-R7 R10 = RES1
R8 R9 = RES1: Manufacturer: Yageo; Manufacturer Part Number: RC0402FR-0724R9L; Description: RES 24.9 OHM 1/16W 1% 0402 SMD; Resistance (Ohms): 24.9; Power (Watts): 0.063W, 1/16W; Temperature Coefficient: ±100ppm/°C; Tolerance: ±1%; Supplier 1: Digi-Key; RoHS: RoHS Compliant; Category: Resistors; Stock 1: 237555; Pricing 1: 10=0.014, 50=0.0104, 100=0.0079, 250=0.00584, 500=0.00432, 1000=0.00288 (USD); Composition: Thick Film; Features: -; Size / Dimension: 0.039" L x 0.020" W (1.00mm x 0.50mm); Height: 0.014" (0.35mm); Number of Terminations: 2; Packaging: Cut Tape (CT); Package / Case: 0402 (1005 Metric); ComponentLink1URL: http://www.yageo.com/documents/recent/PYu-RC0402_51_RoHS_L_6.pdf; ComponentLink1Description: http://www.yageo.com/documents/recent/PYu-RC0402_51_RoHS_L_6.pdf; Supplier 2: Digi-Key; Stock 2: 302870; Pricing 2: 10=0.014, 50=0.0104, 100=0.0079, 250=0.00584, 500=0.00432, 1000=0.00288 (USD); ComponentLink2URL: http://www.yageo.com/documents/recent/PYu-RC0603_51_RoHS_L_4.pdf; ComponentLink2Description: http://www.yageo.com/documents/recent/PYu-RC0603_51_RoHS_L_4.pdf
S2 S3 = SW-PB: Switch; Published: 24-Mar-1999; LatestRevisionDate: 17-Jul-2002; LatestRevisionNote: Re-released for DXP Platform.; PackageReference: SPST-2; Publisher: Altium Limited; Supplier 1: Digi-Key
U4 = PN_PAIR: Supplier 1: Digi-Key
U6 = CY8C38XX_100P_ALT: IC, PSoC3; Part Number: 500-00031; Last Edit By: SNF; ALT_SYMBOLS: tqfpa100; Description: IC, PSoC3, 64K, CY8C3866AXI-040, TQFP-100, SMD; CLASS: IC; Operating Temperature Minimum: -40 C; Operating Temperature Maximum: 85 C; Package Size: TQFP-100
L4 L5 = FERRITE
  L4: Supplier 1: Digi-Key
TP1 = Test Point: Supplier 1: Digi-Key; Supplier 2: Digi-Key
U3 = SN65220 USB TVS SOT23-6_0: Supplier 1: Digi-Key

## Sheet 2 - IO Socket 0.SchDoc
size A4
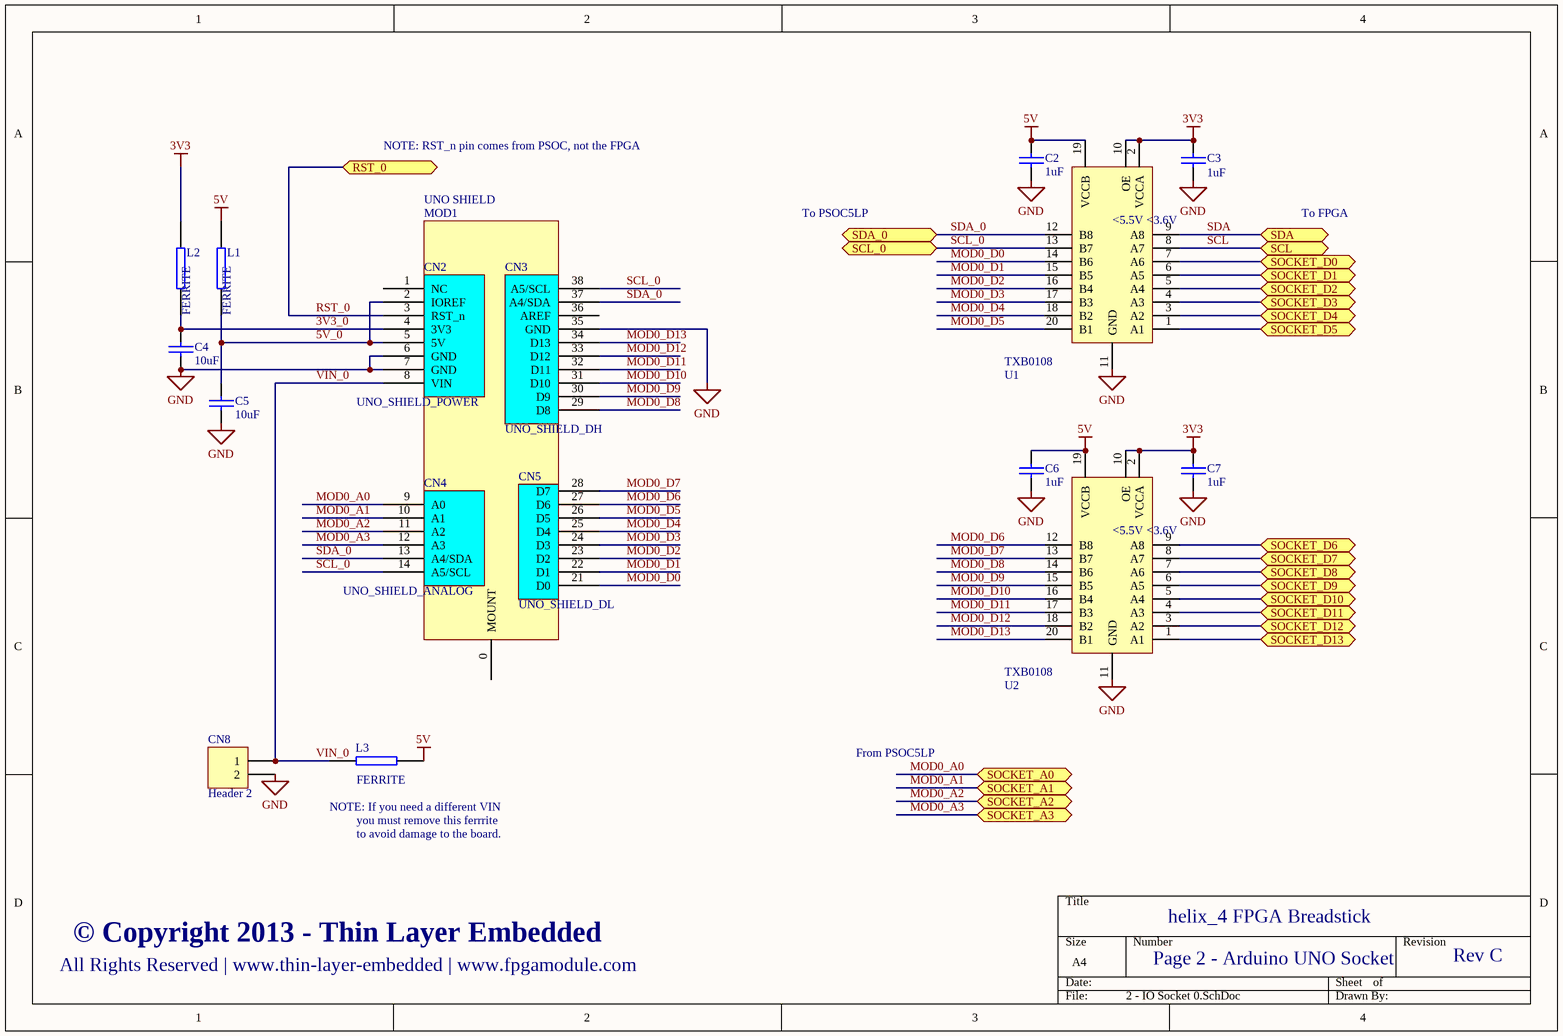
[diagram p3: 2 - IO Socket 0.SchDoc]

### Parts
C2  1uF  [0805]
C3  1uF  [0805]
C4  10uF  [0805]
C5  10uF  [0805]
C6  1uF  [0805]
C7  1uF  [0805]
CN2  UNO_SHIELD_POWER  [UNO_SHIELD_POWER]
CN3  UNO_SHIELD_DH  [UNO_SHIELD_DH]
CN4  UNO_SHIELD_ANALOG  [UNO_SHIELD_ANALOG]
CN5  UNO_SHIELD_DL  [UNO_SHIELD_DL]
CN8  Header 2  [HDR1X2]
L1  FERRITE  [0805]
L2  FERRITE  [0805]
L3  FERRITE  [0805]
MOD1  UNO SHIELD  [UNO_SHIELD_MECH_NO_OUTLINE]
U1  TXB0108  [TSSOP20]
U2  TXB0108  [TSSOP20]

### Ports
RST_0, SCL, SCL_0, SDA, SDA_0, SOCKET_A0, SOCKET_A1, SOCKET_A2, SOCKET_A3, SOCKET_D0, SOCKET_D1, SOCKET_D2, SOCKET_D3, SOCKET_D4, SOCKET_D5, SOCKET_D6, SOCKET_D7, SOCKET_D8, SOCKET_D9, SOCKET_D10, SOCKET_D11, SOCKET_D12, SOCKET_D13

### Nets
3V3: C3.2 C7.2 L2.1 U1.2(VCCA) U1.10(OE) U2.2(VCCA) U2.10(OE)
5V: C2.2 C6.2 L1.1 L3.1 U1.19(VCCB) U2.19(VCCB)
GND: C2.1 C3.1 C4.2 C5.2 C6.1 C7.1 CN2.6(GND) CN2.7(GND) CN3.35(GND) CN8.2 U1.11(GND) U2.11(GND)
3V3_0: C4.1 CN2.4(3V3) L2.2
5V_0: C5.1 CN2.2(IOREF) CN2.5(5V) L1.2
MOD0_A0: CN4.9(A0) ; port SOCKET_A0
MOD0_A1: CN4.10(A1) ; port SOCKET_A1
MOD0_A2: CN4.11(A2) ; port SOCKET_A2
MOD0_A3: CN4.12(A3) ; port SOCKET_A3
MOD0_D0: CN5.21(D0) U1.14(B6)
MOD0_D1: CN5.22(D1) U1.15(B5)
MOD0_D2: CN5.23(D2) U1.16(B4)
MOD0_D3: CN5.24(D3) U1.17(B3)
MOD0_D4: CN5.25(D4) U1.18(B2)
MOD0_D5: CN5.26(D5) U1.20(B1)
MOD0_D6: CN5.27(D6) U2.12(B8)
MOD0_D7: CN5.28(D7) U2.13(B7)
MOD0_D8: CN3.29(D8) U2.14(B6)
MOD0_D9: CN3.30(D9) U2.15(B5)
MOD0_D10: CN3.31(D10) U2.16(B4)
MOD0_D11: CN3.32(D11) U2.17(B3)
MOD0_D12: CN3.33(D12) U2.18(B2)
MOD0_D13: CN3.34(D13) U2.20(B1)
RST_0: CN2.3(RST_n) ; port RST_0
SCL: U1.8(A7) ; port SCL
SCL_0: CN3.38(A5/SCL) CN4.14(A5/SCL) U1.13(B7) ; port SCL_0
SDA: U1.9(A8) ; port SDA
SDA_0: CN3.37(A4/SDA) CN4.13(A4/SDA) U1.12(B8) ; port SDA_0
VIN_0: CN2.8(VIN) CN8.1 L3.2
NetU1_1: U1.1(A1) ; port SOCKET_D5
NetU1_3: U1.3(A2) ; port SOCKET_D4
NetU1_4: U1.4(A3) ; port SOCKET_D3
NetU1_5: U1.5(A4) ; port SOCKET_D2
NetU1_6: U1.6(A5) ; port SOCKET_D1
NetU1_7: U1.7(A6) ; port SOCKET_D0
NetU2_1: U2.1(A1) ; port SOCKET_D13
NetU2_3: U2.3(A2) ; port SOCKET_D12
NetU2_4: U2.4(A3) ; port SOCKET_D11
NetU2_5: U2.5(A4) ; port SOCKET_D10
NetU2_6: U2.6(A5) ; port SOCKET_D9
NetU2_7: U2.7(A6) ; port SOCKET_D8
NetU2_8: U2.8(A7) ; port SOCKET_D7
NetU2_9: U2.9(A8) ; port SOCKET_D6

Not connected (* = marked no-connect by the designer): CN2 1(NC); CN3 36(AREF); MOD1 0(MOUNT)

### Notes on the sheet
- NOTE: RST_n pin comes from PSOC, not the FPGA
- To PSOC5LP
- To FPGA
- From PSOC5LP
- (near L3) NOTE: If you need a different VIN
- you must remove this ferrrite
- to avoid damage to the board.
- helix_4 FPGA Breadstick
- All Rights Reserved | www.thin-layer-embedded | www.fpgamodule.com
- © Copyright 2013 - Thin Layer Embedded
- Page 2 - Arduino UNO Socket
- Rev C
- (in symbol TXB0108) <5.5V; <3.6V

### Library data of the parts
C2-C7 = CAP: Capacitor
CN8 = Header 2: Header, 2-Pin; LatestRevisionDate: 17-Jul-2002; LatestRevisionNote: Re-released for DXP Platform.; Publisher: Altium Limited
MOD1 = UNO_SHIELD_MECH
U1 U2 = TXB0108: TI Bir-dir buffer

## Nets that join several sheets
3V3: 1 - Top (CN10.15 MOD3.94 MOD3.95), 3 - PSOC & Power (U6.52 U6.67), 2 - IO Socket 0 (7 pins)
5V: 1 - Top (CN6.1 CN11.1 MOD3.26), 3 - PSOC & Power (C9.1 U4.D2), 2 - IO Socket 0 (6 pins)
GND: 1 - Top (48 pins), 3 - PSOC & Power (29 pins), 2 - IO Socket 0 (12 pins)